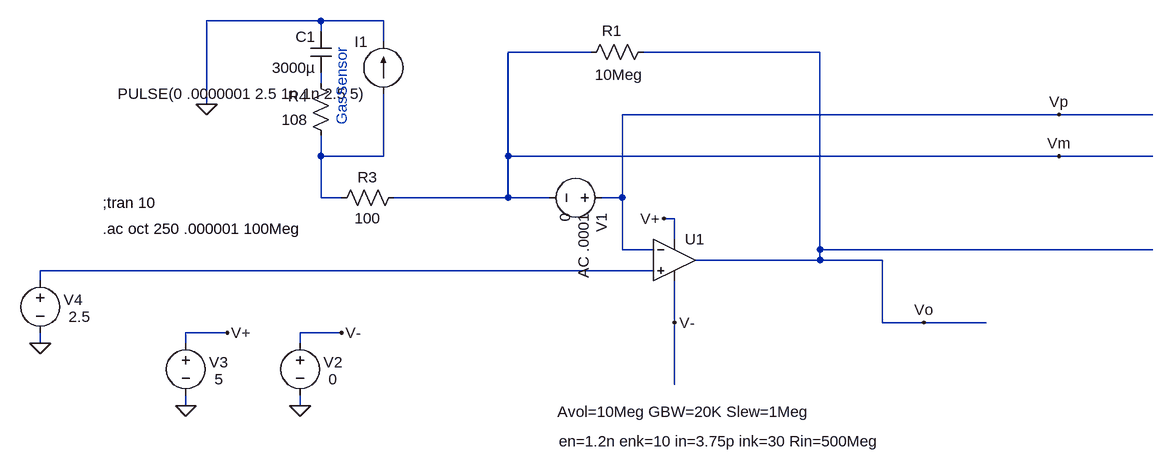
[diagram p0: schematic GasSensorStability.asc]
GasSensorStability.asc, the LTspice schematic file:
Version 4
SHEET 1 1928 1456
WIRE -5472 -3424 -5648 -3424
WIRE -5376 -3424 -5472 -3424
WIRE -5472 -3408 -5472 -3424
WIRE -5376 -3392 -5376 -3424
WIRE -5056 -3376 -5184 -3376
WIRE -4704 -3376 -4976 -3376
WIRE -5472 -3328 -5472 -3344
WIRE -5648 -3296 -5648 -3424
WIRE -4336 -3280 -5008 -3280
WIRE -4192 -3280 -4336 -3280
WIRE -5472 -3216 -5472 -3248
WIRE -5376 -3216 -5376 -3312
WIRE -5376 -3216 -5472 -3216
WIRE -5184 -3216 -5184 -3376
WIRE -4336 -3216 -5184 -3216
WIRE -4192 -3216 -4336 -3216
WIRE -5472 -3152 -5472 -3216
WIRE -5440 -3152 -5472 -3152
WIRE -5184 -3152 -5184 -3216
WIRE -5184 -3152 -5360 -3152
WIRE -5120 -3152 -5184 -3152
WIRE -5008 -3152 -5008 -3280
WIRE -5008 -3152 -5040 -3152
WIRE -4928 -3120 -4944 -3120
WIRE -4928 -3088 -4928 -3120
WIRE -5008 -3072 -5008 -3152
WIRE -4960 -3072 -5008 -3072
WIRE -4704 -3072 -4704 -3376
WIRE -4192 -3072 -4704 -3072
WIRE -4704 -3056 -4704 -3072
WIRE -4704 -3056 -4896 -3056
WIRE -4608 -3056 -4704 -3056
WIRE -4960 -3040 -5904 -3040
WIRE -5904 -3024 -5904 -3040
WIRE -4928 -2960 -4928 -3024
WIRE -4608 -2960 -4608 -3056
WIRE -4544 -2960 -4608 -2960
WIRE -4448 -2960 -4544 -2960
WIRE -5616 -2944 -5680 -2944
WIRE -5440 -2944 -5504 -2944
WIRE -5904 -2928 -5904 -2944
WIRE -5680 -2928 -5680 -2944
WIRE -5504 -2928 -5504 -2944
WIRE -4928 -2864 -4928 -2960
WIRE -5680 -2832 -5680 -2848
WIRE -5504 -2832 -5504 -2848
FLAG -4944 -3120 V+
FLAG -5616 -2944 V+
FLAG -5680 -2832 0
FLAG -5440 -2944 V-
FLAG -5504 -2832 0
FLAG -4928 -2960 V-
FLAG -4544 -2960 Vo
FLAG -5648 -3296 0
FLAG -5904 -2928 0
FLAG -4336 -3280 Vp
FLAG -4336 -3216 Vm
SYMBOL Opamps\\UniversalOpamp2 -4928 -3056 R0
WINDOW 123 -180 233 Left 2
WINDOW 40 -178 279 Left 2
SYMATTR Value2 Avol=10Meg GBW=20K Slew=1Meg
SYMATTR SpiceLine2 en=1.2n enk=10 in=3.75p ink=30 Rin=500Meg
SYMATTR InstName U1
SYMBOL voltage -5680 -2944 R0
WINDOW 0 36 45 Left 2
WINDOW 3 44 71 Left 2
WINDOW 123 0 0 Left 2
WINDOW 39 0 0 Left 2
SYMATTR InstName V3
SYMATTR Value 5
SYMBOL res -4960 -3392 R90
WINDOW 0 -1 64 VBottom 2
WINDOW 3 35 53 VTop 2
SYMATTR InstName R1
SYMATTR Value 10Meg
SYMBOL voltage -5504 -2944 R0
WINDOW 0 36 45 Left 2
WINDOW 3 44 71 Left 2
WINDOW 123 0 0 Left 2
WINDOW 39 0 0 Left 2
SYMATTR InstName V2
SYMATTR Value 0
SYMBOL voltage -5024 -3152 R90
WINDOW 123 24 44 Left 2
WINDOW 39 0 0 Left 2
WINDOW 3 24 72 Left 2
SYMATTR Value2 AC .0001
SYMATTR Value 0
SYMATTR InstName V1
SYMBOL cap -5456 -3408 M0
SYMATTR InstName C1
SYMATTR Value 3000µ
SYMBOL res -5344 -3168 R90
WINDOW 0 0 56 VBottom 2
WINDOW 3 32 56 VTop 2
SYMATTR InstName R3
SYMATTR Value 100
SYMBOL res -5456 -3232 R180
WINDOW 0 36 76 Left 2
WINDOW 3 36 40 Left 2
SYMATTR InstName R4
SYMATTR Value 108
SYMBOL current -5376 -3312 R180
WINDOW 0 24 80 Left 2
WINDOW 3 24 0 Left 2
WINDOW 123 0 0 Left 2
WINDOW 39 0 0 Left 2
SYMATTR InstName I1
SYMATTR Value PULSE(0 .0000001 2.5 1n 1n 2.5 5)
SYMBOL voltage -5904 -3040 R0
WINDOW 0 36 45 Left 2
WINDOW 3 44 71 Left 2
WINDOW 123 0 0 Left 2
WINDOW 39 0 0 Left 2
SYMATTR InstName V4
SYMATTR Value 2.5
TEXT -5808 -3104 Left 2 !.ac oct 250 .000001 100Meg
TEXT -5808 -3144 Left 2 !;tran 10
TEXT -5440 -3384 VRight 2 ;GasSensor

The netlist it stands for:
* GasSensorStability.asc
XU1 N003 Vp V+ V- Vo level.2 Avol=10Meg GBW=20K Slew=1Meg ilimit=25m rail=0 Vos=0 phimargin=45 en=1.2n enk=10 in=3.75p ink=30 Rin=500Meg  ; pins IN+ IN- V+ V- OUT
V3 V+ 0 5
R1 Vo Vm 10Meg
V2 V- 0 0
V1 Vp Vm 0 AC .0001
C1 0 N001 3000µ
R3 Vm N002 100
R4 N002 N001 108
I1 N002 0 PULSE(0 .0000001 2.5 1n 1n 2.5 5)
V4 N003 0 2.5
.ac oct 250 .000001 100Meg
;tran 10
* GasSensor
.lib UniversalOpamps2.sub
.backanno
.end